# EAGLE schematic Main DIY board (EAGLE 9.0.0)
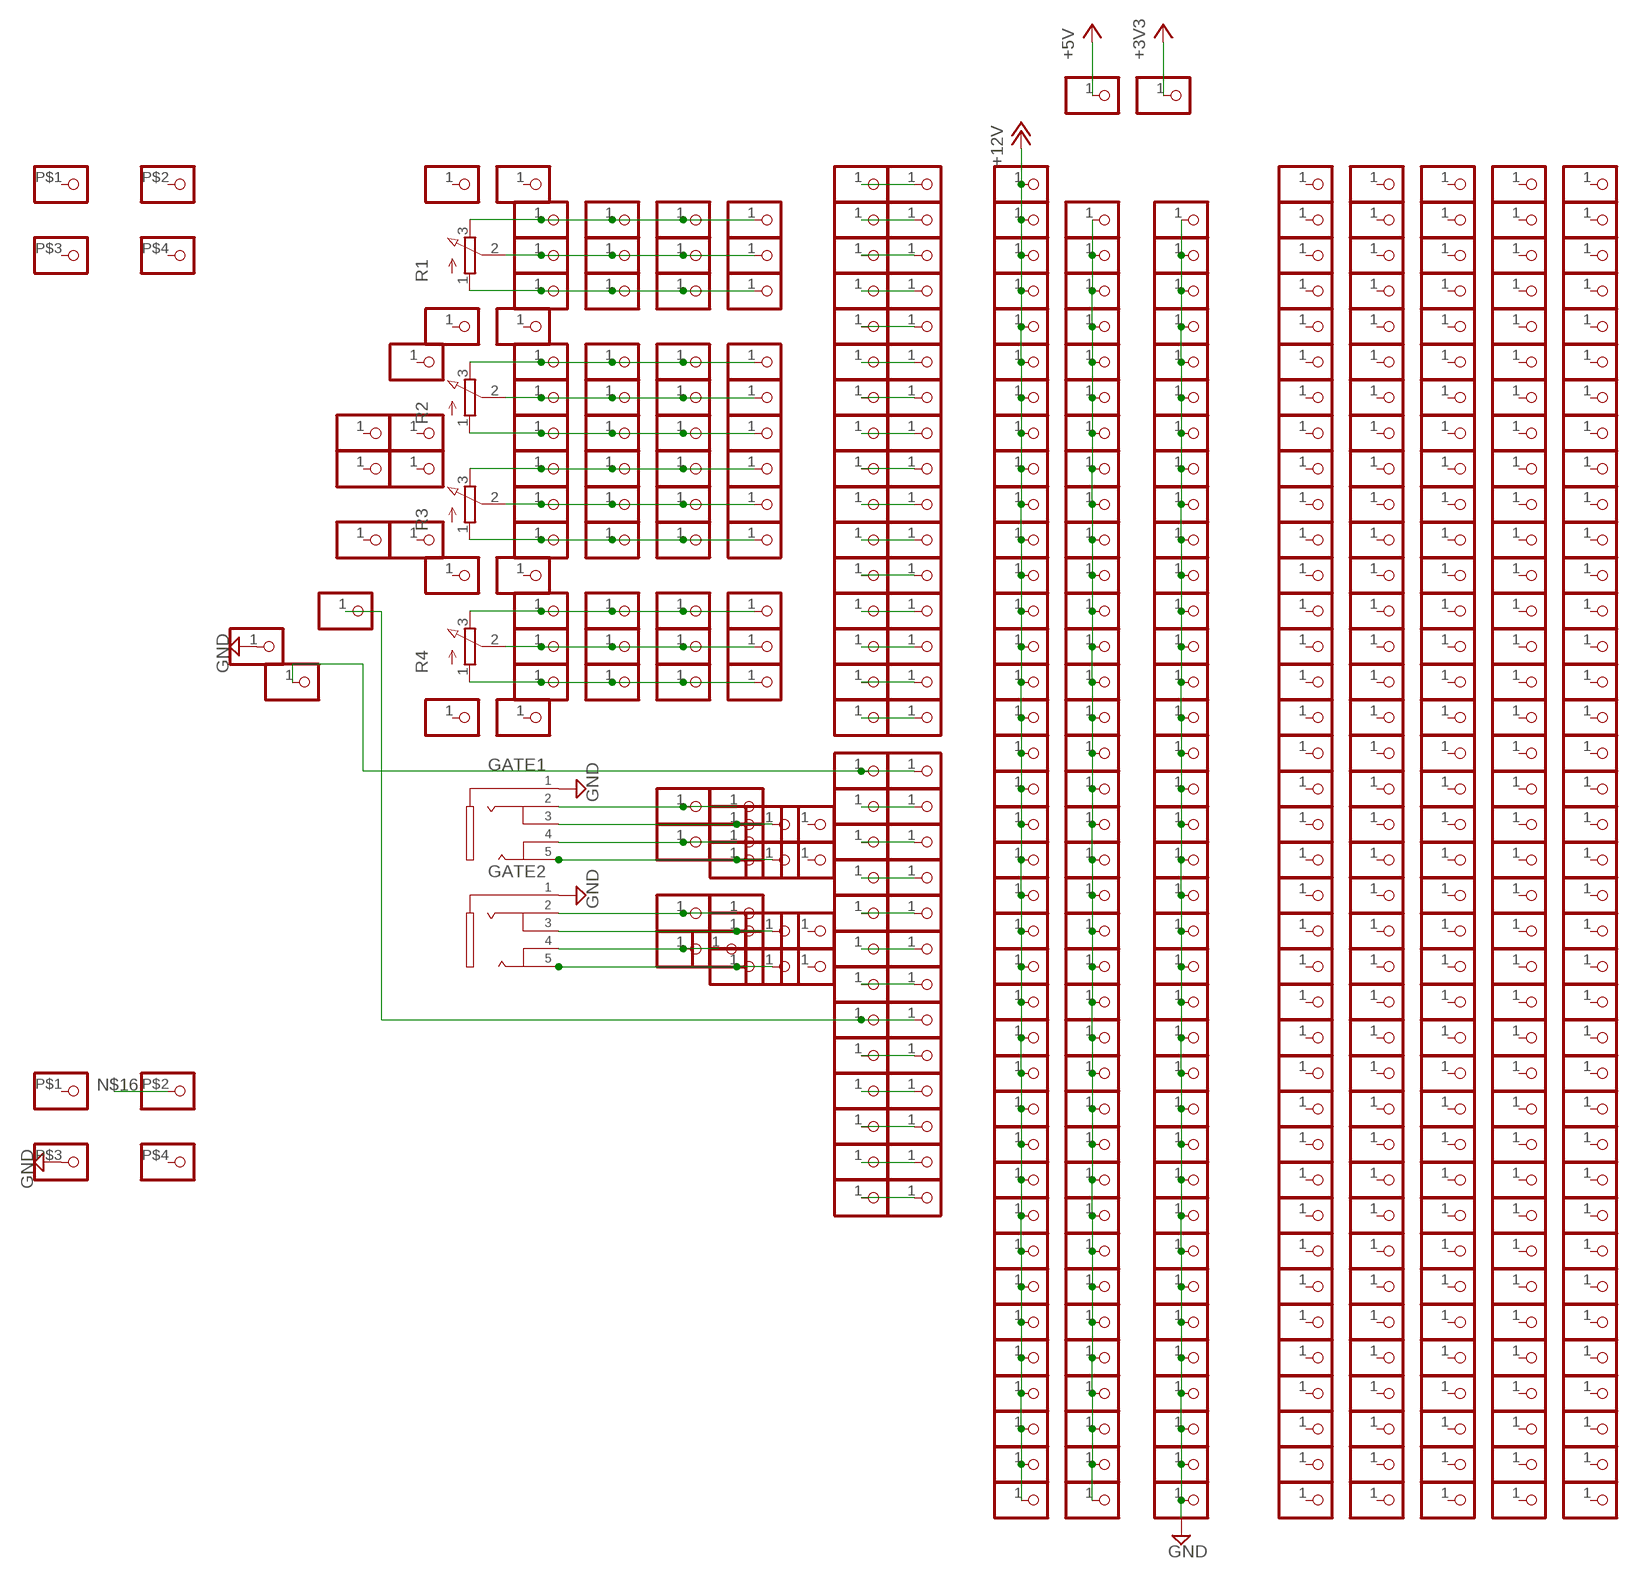
[diagram p0: schematic, sheet 1, part 1 of 2]
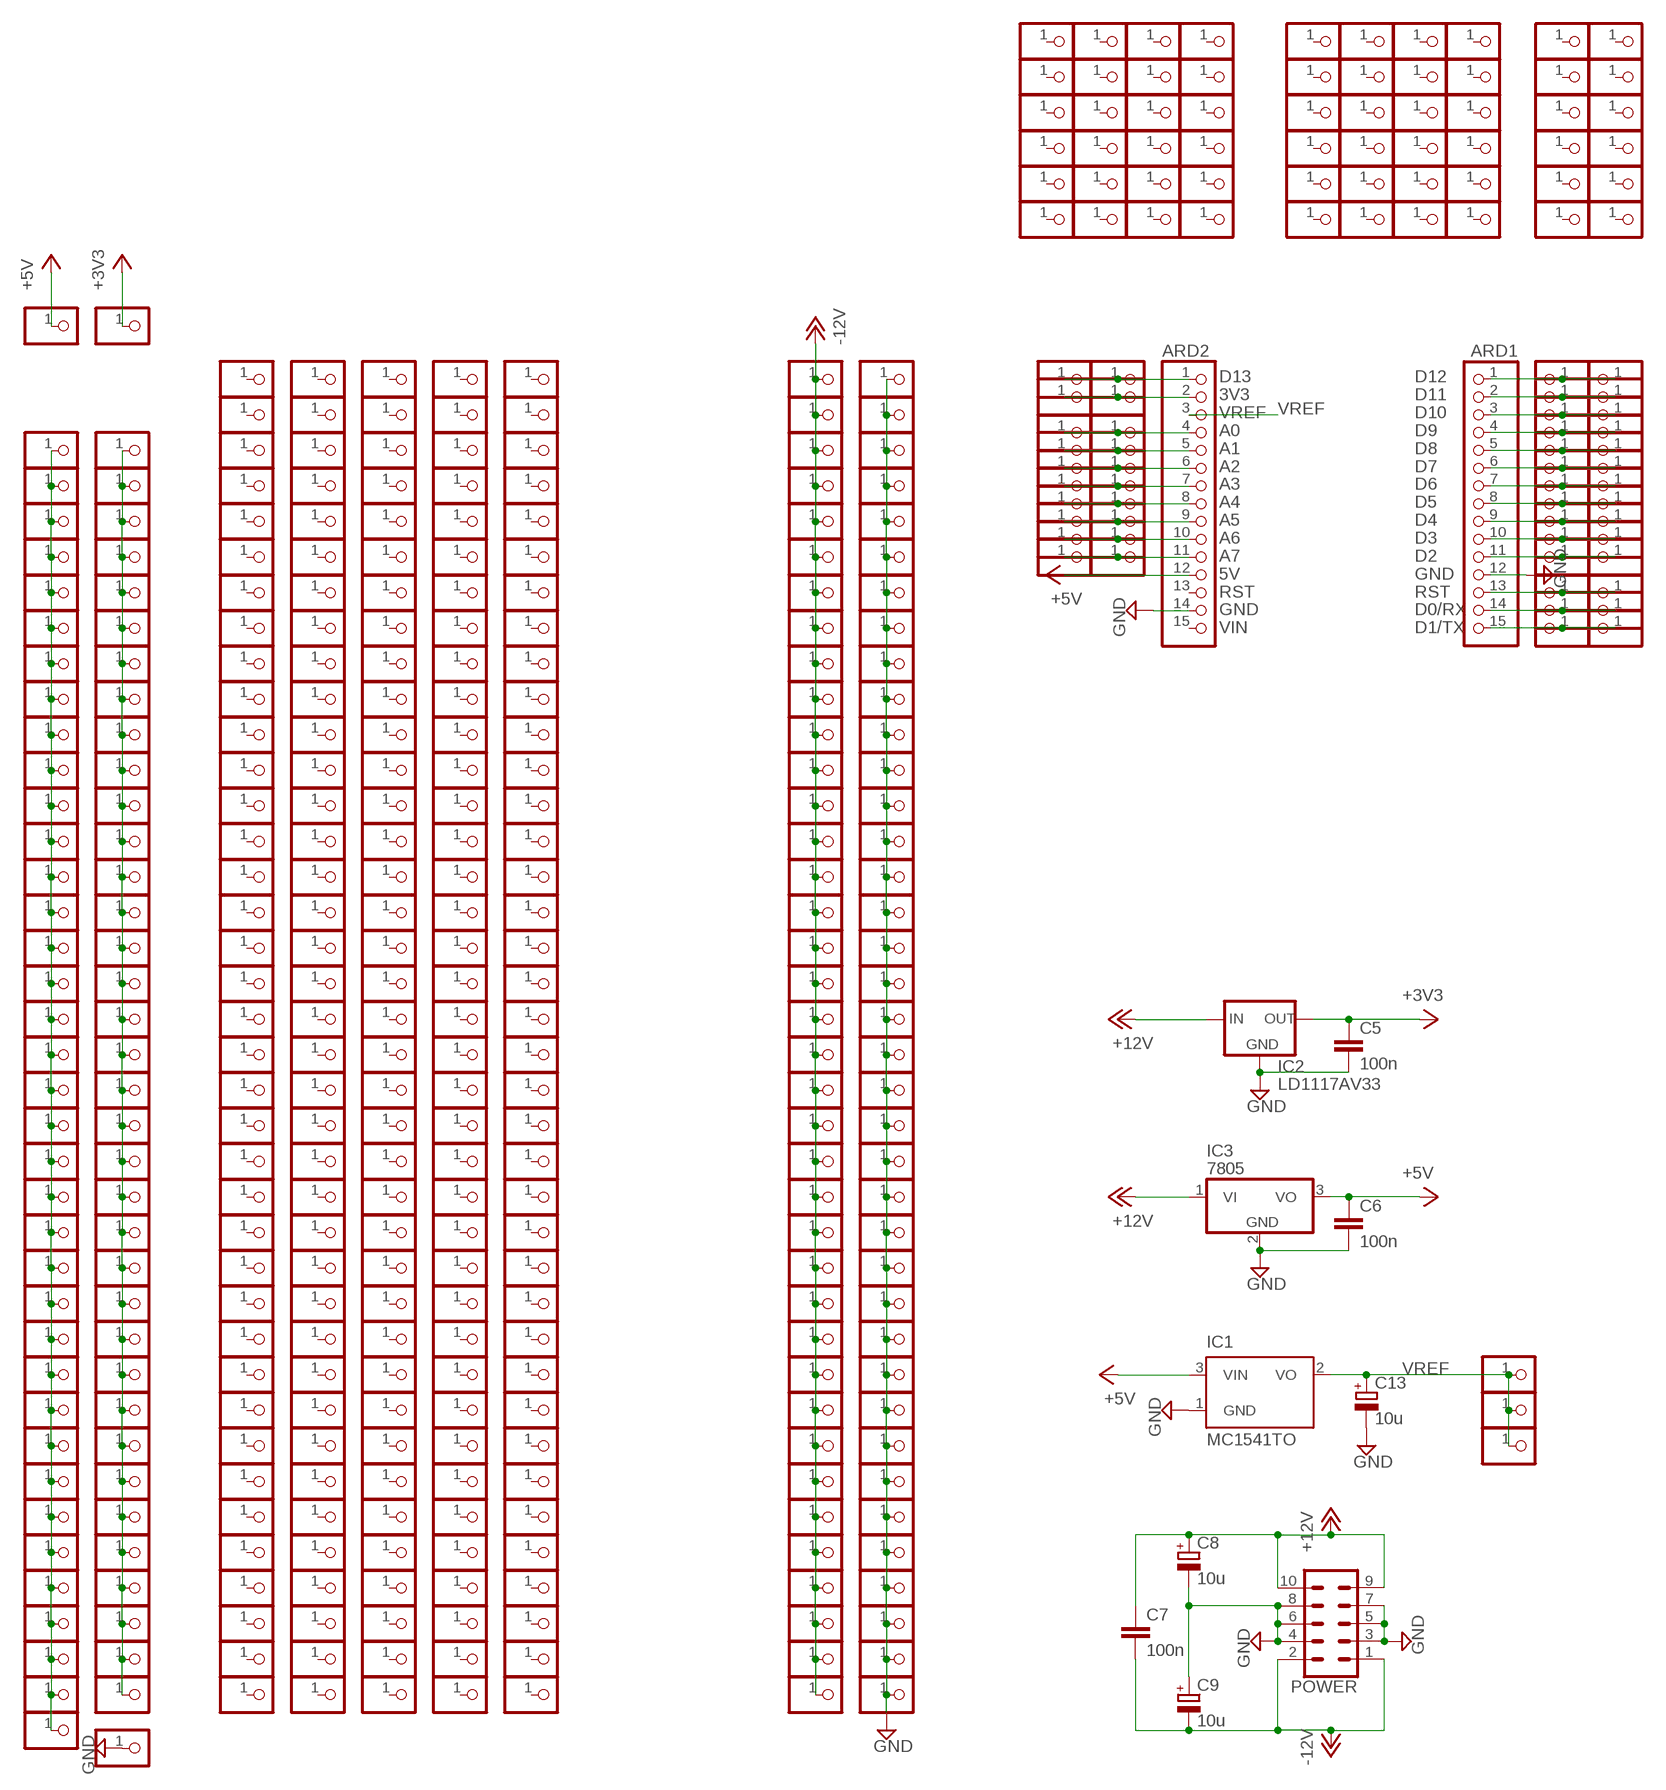
[diagram p1: schematic, sheet 1, part 2 of 2]

## Parts
ARD1  PINHD-1X15  [1X15]
ARD2  PINHD-1X15  [1X15]
C5  100n  C-EU050-025X075  [C050-025X075]
C6  100n  C-EU050-025X075  [C050-025X075]
C7  100n  C-EU050-025X075  [C050-025X075]
C8  10u  CPOL  [E2,5-5]
C9  10u  CPOL  [E2,5-5]
C13  10u  CPOL  [E2,5-5]
GATE1  PJ-324MH  [PJ-324MH]
GATE2  PJ-324MH  [PJ-324MH]
IC1  MC1541TO  [TO92]
IC2  LD1117AV33  V_REG_LD1117VXX  [78XXL]
IC3  7805  7805T  [TO220H]
JP1  1X01  [1X01]
JP2  1X01  [1X01]
JP3  1X01  [1X01]
JP4  1X01  [1X01]
JP5  1X01  [1X01]
JP6  1X01  [1X01]
JP7  1X01  [1X01]
JP8  1X01  [1X01]
JP9  1X01  [1X01]
JP10  1X01  [1X01]
JP11  1X01  [1X01]
JP12  1X01  [1X01]
JP13  1X01  [1X01]
JP14  1X01  [1X01]
JP15  1X01  [1X01]
JP16  1X01  [1X01]
JP17  1X01  [1X01]
JP18  1X01  [1X01]
JP19  1X01  [1X01]
JP20  1X01  [1X01]
JP21  1X01  [1X01]
JP22  1X01  [1X01]
JP23  1X01  [1X01]
JP24  1X01  [1X01]
JP25  1X01  [1X01]
JP26  1X01  [1X01]
JP27  1X01  [1X01]
JP28  1X01  [1X01]
JP29  1X01  [1X01]
JP30  1X01  [1X01]
JP31  1X01  [1X01]
JP32  1X01  [1X01]
JP33  1X01  [1X01]
JP34  1X01  [1X01]
JP35  1X01  [1X01]
JP36  1X01  [1X01]
JP37  1X01  [1X01]
JP38  1X01  [1X01]
JP39  1X01  [1X01]
JP40  1X01  [1X01]
JP41  1X01  [1X01]
JP42  1X01  [1X01]
JP43  1X01  [1X01]
JP44  1X01  [1X01]
JP45  1X01  [1X01]
JP46  1X01  [1X01]
JP47  1X01  [1X01]
JP48  1X01  [1X01]
JP49  1X01  [1X01]
JP50  1X01  [1X01]
JP51  1X01  [1X01]
JP52  1X01  [1X01]
JP53  1X01  [1X01]
JP54  1X01  [1X01]
JP55  1X01  [1X01]
JP56  1X01  [1X01]
JP57  1X01  [1X01]
JP58  1X01  [1X01]
JP59  1X01  [1X01]
JP60  1X01  [1X01]
JP61  1X01  [1X01]
JP62  1X01  [1X01]
JP63  1X01  [1X01]
JP64  1X01  [1X01]
JP65  1X01  [1X01]
JP66  1X01  [1X01]
JP67  1X01  [1X01]
JP68  1X01  [1X01]
JP69  1X01  [1X01]
JP70  1X01  [1X01]
JP71  1X01  [1X01]
JP72  1X01  [1X01]
JP73  1X01  [1X01]
JP74  1X01  [1X01]
JP75  1X01  [1X01]
JP76  1X01  [1X01]
JP77  1X01  [1X01]
JP78  1X01  [1X01]
JP79  1X01  [1X01]
JP80  1X01  [1X01]
JP81  1X01  [1X01]
JP82  1X01  [1X01]
JP83  1X01  [1X01]
JP84  1X01  [1X01]
JP85  1X01  [1X01]
JP86  1X01  [1X01]
JP87  1X01  [1X01]
JP88  1X01  [1X01]
JP89  1X01  [1X01]
JP90  1X01  [1X01]
JP91  1X01  [1X01]
JP92  1X01  [1X01]
JP93  1X01  [1X01]
JP94  1X01  [1X01]
JP95  1X01  [1X01]
JP96  1X01  [1X01]
JP97  1X01  [1X01]
JP98  1X01  [1X01]
JP99  1X01  [1X01]
JP100  1X01  [1X01]
JP101  1X01  [1X01]
JP102  1X01  [1X01]
JP103  1X01  [1X01]
JP104  1X01  [1X01]
JP105  1X01  [1X01]
JP106  1X01  [1X01]
JP107  1X01  [1X01]
JP108  1X01  [1X01]
JP109  1X01  [1X01]
JP110  1X01  [1X01]
JP111  1X01  [1X01]
JP112  1X01  [1X01]
JP113  1X01  [1X01]
JP114  1X01  [1X01]
JP115  1X01  [1X01]
JP116  1X01  [1X01]
JP117  1X01  [1X01]
JP118  1X01  [1X01]
JP119  1X01  [1X01]
JP120  1X01  [1X01]
JP121  1X01  [1X01]
JP122  1X01  [1X01]
JP123  1X01  [1X01]
JP124  1X01  [1X01]
JP125  1X01  [1X01]
JP126  1X01  [1X01]
JP127  1X01  [1X01]
JP128  1X01  [1X01]
JP129  1X01  [1X01]
JP130  1X01  [1X01]
JP131  1X01  [1X01]
JP132  1X01  [1X01]
JP133  1X01  [1X01]
JP134  1X01  [1X01]
JP135  1X01  [1X01]
JP136  1X01  [1X01]
JP137  1X01  [1X01]
JP138  1X01  [1X01]
JP139  1X01  [1X01]
JP140  1X01  [1X01]
JP141  1X01  [1X01]
JP142  1X01  [1X01]
JP143  1X01  [1X01]
JP144  1X01  [1X01]
JP145  1X01  [1X01]
JP146  1X01  [1X01]
JP147  1X01  [1X01]
JP148  1X01  [1X01]
JP149  1X01  [1X01]
JP150  1X01  [1X01]
JP151  1X01  [1X01]
JP152  1X01  [1X01]
JP153  1X01  [1X01]
JP154  1X01  [1X01]
JP155  1X01  [1X01]
JP156  1X01  [1X01]
JP157  1X01  [1X01]
JP158  1X01  [1X01]
JP159  1X01  [1X01]
JP160  1X01  [1X01]
JP161  1X01  [1X01]
JP162  1X01  [1X01]
JP163  1X01  [1X01]
JP164  1X01  [1X01]
JP165  1X01  [1X01]
JP166  1X01  [1X01]
JP167  1X01  [1X01]
JP168  1X01  [1X01]
JP169  1X01  [1X01]
JP170  1X01  [1X01]
JP171  1X01  [1X01]
JP172  1X01  [1X01]
JP173  1X01  [1X01]
JP174  1X01  [1X01]
JP175  1X01  [1X01]
JP176  1X01  [1X01]
JP177  1X01  [1X01]
JP178  1X01  [1X01]
JP179  1X01  [1X01]
JP180  1X01  [1X01]
JP181  1X01  [1X01]
JP182  1X01  [1X01]
JP183  1X01  [1X01]
JP184  1X01  [1X01]
JP185  1X01  [1X01]
JP186  1X01  [1X01]
JP187  1X01  [1X01]
JP188  1X01  [1X01]
JP189  1X01  [1X01]
JP190  1X01  [1X01]
JP191  1X01  [1X01]
JP192  1X01  [1X01]
JP193  1X01  [1X01]
JP194  1X01  [1X01]
JP195  1X01  [1X01]
JP196  1X01  [1X01]
JP197  1X01  [1X01]
JP198  1X01  [1X01]
JP199  1X01  [1X01]
JP200  1X01  [1X01]
JP201  1X01  [1X01]
JP202  1X01  [1X01]
JP203  1X01  [1X01]
JP204  1X01  [1X01]
JP205  1X01  [1X01]
JP206  1X01  [1X01]
JP207  1X01  [1X01]
JP208  1X01  [1X01]
JP209  1X01  [1X01]
JP210  1X01  [1X01]
JP211  1X01  [1X01]
JP212  1X01  [1X01]
JP213  1X01  [1X01]
JP214  1X01  [1X01]
JP215  1X01  [1X01]
JP216  1X01  [1X01]
JP217  1X01  [1X01]
JP218  1X01  [1X01]
JP219  1X01  [1X01]
JP220  1X01  [1X01]
JP221  1X01  [1X01]
JP222  1X01  [1X01]
JP223  1X01  [1X01]
JP224  1X01  [1X01]
JP225  1X01  [1X01]
JP226  1X01  [1X01]
JP227  1X01  [1X01]
JP228  1X01  [1X01]
JP229  1X01  [1X01]
JP230  1X01  [1X01]
JP231  1X01  [1X01]
JP232  1X01  [1X01]
JP233  1X01  [1X01]
JP234  1X01  [1X01]
JP235  1X01  [1X01]
JP236  1X01  [1X01]
JP237  1X01  [1X01]
JP238  1X01  [1X01]
JP239  1X01  [1X01]
JP240  1X01  [1X01]
JP241  1X01  [1X01]
JP242  1X01  [1X01]
JP243  1X01  [1X01]
JP244  1X01  [1X01]
JP245  1X01  [1X01]
JP246  1X01  [1X01]
JP247  1X01  [1X01]
JP248  1X01  [1X01]
JP249  1X01  [1X01]
JP250  1X01  [1X01]
JP251  1X01  [1X01]
JP252  1X01  [1X01]
JP253  1X01  [1X01]
JP254  1X01  [1X01]
JP255  1X01  [1X01]
JP256  1X01  [1X01]
JP257  1X01  [1X01]
JP258  1X01  [1X01]
JP259  1X01  [1X01]
JP260  1X01  [1X01]
JP261  1X01  [1X01]
JP262  1X01  [1X01]
JP263  1X01  [1X01]
JP264  1X01  [1X01]
JP265  1X01  [1X01]
JP266  1X01  [1X01]
JP267  1X01  [1X01]
JP268  1X01  [1X01]
JP269  1X01  [1X01]
JP270  1X01  [1X01]
JP271  1X01  [1X01]
JP272  1X01  [1X01]
JP273  1X01  [1X01]
JP274  1X01  [1X01]
JP275  1X01  [1X01]
JP276  1X01  [1X01]
JP277  1X01  [1X01]
JP278  1X01  [1X01]
JP279  1X01  [1X01]
JP280  1X01  [1X01]
JP281  1X01  [1X01]
JP282  1X01  [1X01]
JP283  1X01  [1X01]
JP284  1X01  [1X01]
JP285  1X01  [1X01]
JP286  1X01  [1X01]
JP287  1X01  [1X01]
JP288  1X01  [1X01]
JP289  1X01  [1X01]
JP290  1X01  [1X01]
JP291  1X01  [1X01]
JP292  1X01  [1X01]
JP293  1X01  [1X01]
JP294  1X01  [1X01]
JP295  1X01  [1X01]
JP296  1X01  [1X01]
JP297  1X01  [1X01]
JP298  1X01  [1X01]
JP299  1X01  [1X01]
JP300  1X01  [1X01]
JP301  1X01  [1X01]
JP302  1X01  [1X01]
JP303  1X01  [1X01]
JP304  1X01  [1X01]
JP305  1X01  [1X01]
JP306  1X01  [1X01]
JP307  1X01  [1X01]
JP308  1X01  [1X01]
JP309  1X01  [1X01]
JP310  1X01  [1X01]
JP311  1X01  [1X01]
JP312  1X01  [1X01]
JP313  1X01  [1X01]
JP314  1X01  [1X01]
JP315  1X01  [1X01]
JP316  1X01  [1X01]
JP317  1X01  [1X01]
JP318  1X01  [1X01]
JP319  1X01  [1X01]
JP320  1X01  [1X01]
JP321  1X01  [1X01]
JP322  1X01  [1X01]
JP323  1X01  [1X01]
JP324  1X01  [1X01]
JP325  1X01  [1X01]
JP326  1X01  [1X01]
JP327  1X01  [1X01]
JP328  1X01  [1X01]
JP329  1X01  [1X01]
JP330  1X01  [1X01]
JP331  1X01  [1X01]
JP332  1X01  [1X01]
JP333  1X01  [1X01]
JP334  1X01  [1X01]
JP335  1X01  [1X01]
JP336  1X01  [1X01]
JP337  1X01  [1X01]
JP338  1X01  [1X01]
JP339  1X01  [1X01]
JP340  1X01  [1X01]
JP341  1X01  [1X01]
JP342  1X01  [1X01]
JP343  1X01  [1X01]
JP344  1X01  [1X01]
JP345  1X01  [1X01]
JP346  1X01  [1X01]
JP347  1X01  [1X01]
JP348  1X01  [1X01]
JP349  1X01  [1X01]
JP350  1X01  [1X01]
JP351  1X01  [1X01]
JP352  1X01  [1X01]
JP353  1X01  [1X01]
JP354  1X01  [1X01]
JP355  1X01  [1X01]
JP356  1X01  [1X01]
JP357  1X01  [1X01]
JP358  1X01  [1X01]
JP359  1X01  [1X01]
JP360  1X01  [1X01]
JP361  1X01  [1X01]
JP362  1X01  [1X01]
JP363  1X01  [1X01]
JP364  1X01  [1X01]
JP365  1X01  [1X01]
JP366  1X01  [1X01]
JP367  1X01  [1X01]
JP368  1X01  [1X01]
JP369  1X01  [1X01]
JP370  1X01  [1X01]
JP371  1X01  [1X01]
JP372  1X01  [1X01]
JP373  1X01  [1X01]
JP374  1X01  [1X01]
JP375  1X01  [1X01]
JP376  1X01  [1X01]
JP377  1X01  [1X01]
JP378  1X01  [1X01]
JP379  1X01  [1X01]
JP380  1X01  [1X01]
JP381  1X01  [1X01]
JP382  1X01  [1X01]
JP383  1X01  [1X01]
JP384  1X01  [1X01]
JP385  1X01  [1X01]
JP386  1X01  [1X01]
JP387  1X01  [1X01]
JP388  1X01  [1X01]
JP389  1X01  [1X01]
JP390  1X01  [1X01]
JP391  1X01  [1X01]
JP392  1X01  [1X01]
JP393  1X01  [1X01]
JP394  1X01  [1X01]
JP395  1X01  [1X01]
JP396  1X01  [1X01]
JP397  1X01  [1X01]
JP398  1X01  [1X01]
JP399  1X01  [1X01]
JP400  1X01  [1X01]
JP401  1X01  [1X01]
JP402  1X01  [1X01]
JP403  1X01  [1X01]
JP404  1X01  [1X01]
JP405  1X01  [1X01]
JP406  1X01  [1X01]
JP407  1X01  [1X01]
JP408  1X01  [1X01]
JP409  1X01  [1X01]
JP410  1X01  [1X01]
JP411  1X01  [1X01]
JP412  1X01  [1X01]
JP413  1X01  [1X01]
JP414  1X01  [1X01]
JP415  1X01  [1X01]
JP416  1X01  [1X01]
JP417  1X01  [1X01]
JP418  1X01  [1X01]
JP419  1X01  [1X01]
JP420  1X01  [1X01]
JP421  1X01  [1X01]
JP422  1X01  [1X01]
JP423  1X01  [1X01]
JP424  1X01  [1X01]
JP425  1X01  [1X01]
JP426  1X01  [1X01]
JP427  1X01  [1X01]
JP428  1X01  [1X01]
JP429  1X01  [1X01]
JP430  1X01  [1X01]
JP431  1X01  [1X01]
JP432  1X01  [1X01]
JP433  1X01  [1X01]
JP434  1X01  [1X01]
JP435  1X01  [1X01]
JP436  1X01  [1X01]
JP437  1X01  [1X01]
JP438  1X01  [1X01]
JP439  1X01  [1X01]
JP440  1X01  [1X01]
JP441  1X01  [1X01]
JP442  1X01  [1X01]
JP443  1X01  [1X01]
JP444  1X01  [1X01]
JP445  1X01  [1X01]
JP446  1X01  [1X01]
JP447  1X01  [1X01]
JP448  1X01  [1X01]
JP449  1X01  [1X01]
JP450  1X01  [1X01]
JP451  1X01  [1X01]
JP452  1X01  [1X01]
JP453  1X01  [1X01]
JP454  1X01  [1X01]
JP455  1X01  [1X01]
JP456  1X01  [1X01]
JP457  1X01  [1X01]
JP458  1X01  [1X01]
JP459  1X01  [1X01]
JP460  1X01  [1X01]
JP461  1X01  [1X01]
JP462  1X01  [1X01]
JP463  1X01  [1X01]
JP464  1X01  [1X01]
JP465  1X01  [1X01]
JP466  1X01  [1X01]
JP467  1X01  [1X01]
JP468  1X01  [1X01]
JP469  1X01  [1X01]
JP470  1X01  [1X01]
JP471  1X01  [1X01]
JP472  1X01  [1X01]
JP473  1X01  [1X01]
JP474  1X01  [1X01]
JP475  1X01  [1X01]
JP476  1X01  [1X01]
JP477  1X01  [1X01]
JP478  1X01  [1X01]
JP479  1X01  [1X01]
JP480  1X01  [1X01]
JP481  1X01  [1X01]
JP482  1X01  [1X01]
JP483  1X01  [1X01]
JP484  1X01  [1X01]
JP485  1X01  [1X01]
JP486  1X01  [1X01]
JP487  1X01  [1X01]
JP488  1X01  [1X01]
JP489  1X01  [1X01]
JP490  1X01  [1X01]
JP491  1X01  [1X01]
JP492  1X01  [1X01]
JP493  1X01  [1X01]
JP494  1X01  [1X01]
JP495  1X01  [1X01]
JP496  1X01  [1X01]
JP497  1X01  [1X01]
JP498  1X01  [1X01]
JP499  1X01  [1X01]
JP500  1X01  [1X01]
JP501  1X01  [1X01]
JP502  1X01  [1X01]
JP503  1X01  [1X01]
JP504  1X01  [1X01]
JP505  1X01  [1X01]
JP506  1X01  [1X01]
JP507  1X01  [1X01]
JP508  1X01  [1X01]
JP509  1X01  [1X01]
JP510  1X01  [1X01]
JP511  1X01  [1X01]
JP512  1X01  [1X01]
JP513  1X01  [1X01]
JP514  1X01  [1X01]
JP515  1X01  [1X01]
JP516  1X01  [1X01]
JP517  1X01  [1X01]
JP518  1X01  [1X01]
JP519  1X01  [1X01]
JP520  1X01  [1X01]
JP521  1X01  [1X01]
JP522  1X01  [1X01]
JP523  1X01  [1X01]
JP524  1X01  [1X01]
JP525  1X01  [1X01]
JP526  1X01  [1X01]
JP527  1X01  [1X01]
JP528  1X01  [1X01]
JP529  1X01  [1X01]
JP530  1X01  [1X01]
JP531  1X01  [1X01]
JP532  1X01  [1X01]
JP533  1X01  [1X01]
JP534  1X01  [1X01]
JP535  1X01  [1X01]
JP536  1X01  [1X01]
JP537  1X01  [1X01]
JP538  1X01  [1X01]
JP539  1X01  [1X01]
JP540  1X01  [1X01]
JP541  1X01  [1X01]
JP542  1X01  [1X01]
JP543  1X01  [1X01]
JP544  1X01  [1X01]
JP545  1X01  [1X01]
JP546  1X01  [1X01]
JP547  1X01  [1X01]
JP548  1X01  [1X01]
JP549  1X01  [1X01]
JP550  1X01  [1X01]
JP551  1X01  [1X01]
JP552  1X01  [1X01]
JP553  1X01  [1X01]
JP554  1X01  [1X01]
JP555  1X01  [1X01]
JP556  1X01  [1X01]
JP557  1X01  [1X01]
JP558  1X01  [1X01]
JP559  1X01  [1X01]
JP560  1X01  [1X01]
JP561  1X01  [1X01]
JP562  1X01  [1X01]
JP563  1X01  [1X01]
JP564  1X01  [1X01]
JP565  1X01  [1X01]
JP566  1X01  [1X01]
JP567  1X01  [1X01]
JP568  1X01  [1X01]
JP569  1X01  [1X01]
JP570  1X01  [1X01]
JP571  1X01  [1X01]
JP572  1X01  [1X01]
JP573  1X01  [1X01]
JP574  1X01  [1X01]
JP575  1X01  [1X01]
JP576  1X01  [1X01]
JP577  1X01  [1X01]
JP578  1X01  [1X01]
JP579  1X01  [1X01]
JP580  1X01  [1X01]
JP581  1X01  [1X01]
JP582  1X01  [1X01]
JP583  1X01  [1X01]
JP584  1X01  [1X01]
JP585  1X01  [1X01]
JP586  1X01  [1X01]
JP587  1X01  [1X01]
JP588  1X01  [1X01]
JP589  1X01  [1X01]
JP590  1X01  [1X01]
JP591  1X01  [1X01]
JP592  1X01  [1X01]
JP593  1X01  [1X01]
JP594  1X01  [1X01]
JP595  1X01  [1X01]
JP596  1X01  [1X01]
JP597  1X01  [1X01]
JP598  1X01  [1X01]
JP599  1X01  [1X01]
JP600  1X01  [1X01]
JP601  1X01  [1X01]
JP602  1X01  [1X01]
JP603  1X01  [1X01]
JP604  1X01  [1X01]
JP605  1X01  [1X01]
JP606  1X01  [1X01]
JP607  1X01  [1X01]
JP608  1X01  [1X01]
JP609  1X01  [1X01]
JP610  1X01  [1X01]
JP611  1X01  [1X01]
JP612  1X01  [1X01]
JP613  1X01  [1X01]
JP614  1X01  [1X01]
JP615  1X01  [1X01]
JP616  1X01  [1X01]
JP617  1X01  [1X01]
JP618  1X01  [1X01]
JP619  1X01  [1X01]
JP620  1X01  [1X01]
JP621  1X01  [1X01]
JP622  1X01  [1X01]
JP623  1X01  [1X01]
JP624  1X01  [1X01]
JP625  1X01  [1X01]
JP626  1X01  [1X01]
JP627  1X01  [1X01]
JP628  1X01  [1X01]
JP629  1X01  [1X01]
JP630  1X01  [1X01]
JP631  1X01  [1X01]
JP632  1X01  [1X01]
JP633  1X01  [1X01]
JP634  1X01  [1X01]
JP635  1X01  [1X01]
JP636  1X01  [1X01]
JP637  1X01  [1X01]
JP638  1X01  [1X01]
JP639  1X01  [1X01]
JP640  1X01  [1X01]
JP641  1X01  [1X01]
JP642  1X01  [1X01]
JP643  1X01  [1X01]
JP644  1X01  [1X01]
JP645  1X01  [1X01]
JP646  1X01  [1X01]
JP647  1X01  [1X01]
JP648  1X01  [1X01]
JP649  1X01  [1X01]
JP650  1X01  [1X01]
JP651  1X01  [1X01]
JP652  1X01  [1X01]
JP653  1X01  [1X01]
JP654  1X01  [1X01]
JP655  1X01  [1X01]
JP656  1X01  [1X01]
JP657  1X01  [1X01]
JP658  1X01  [1X01]
JP659  1X01  [1X01]
JP660  1X01  [1X01]
JP661  1X01  [1X01]
JP662  1X01  [1X01]
JP663  1X01  [1X01]
JP664  1X01  [1X01]
JP665  1X01  [1X01]
JP666  1X01  [1X01]
JP667  1X01  [1X01]
JP668  1X01  [1X01]
JP669  1X01  [1X01]
JP670  1X01  [1X01]
JP671  1X01  [1X01]
JP672  1X01  [1X01]
JP673  1X01  [1X01]
JP674  1X01  [1X01]
JP675  1X01  [1X01]
JP676  1X01  [1X01]
JP677  1X01  [1X01]
JP678  1X01  [1X01]
JP679  1X01  [1X01]
JP680  1X01  [1X01]
JP681  1X01  [1X01]
JP682  1X01  [1X01]
JP683  1X01  [1X01]
JP684  1X01  [1X01]
JP685  1X01  [1X01]
JP686  1X01  [1X01]
JP687  1X01  [1X01]
JP688  1X01  [1X01]
JP689  1X01  [1X01]
JP690  1X01  [1X01]
JP691  1X01  [1X01]
JP692  1X01  [1X01]
JP693  1X01  [1X01]
JP694  1X01  [1X01]
JP695  1X01  [1X01]
JP696  1X01  [1X01]
JP697  1X01  [1X01]
JP698  1X01  [1X01]
JP699  1X01  [1X01]
JP700  1X01  [1X01]
JP701  1X01  [1X01]
JP702  1X01  [1X01]
JP703  1X01  [1X01]
JP704  1X01  [1X01]
JP705  1X01  [1X01]
JP706  1X01  [1X01]
JP707  1X01  [1X01]
JP708  1X01  [1X01]
JP709  1X01  [1X01]
JP710  1X01  [1X01]
JP711  1X01  [1X01]
JP712  1X01  [1X01]
JP713  1X01  [1X01]
JP714  1X01  [1X01]
JP715  1X01  [1X01]
JP716  1X01  [1X01]
JP717  1X01  [1X01]
JP718  1X01  [1X01]
JP719  1X01  [1X01]
JP720  1X01  [1X01]
JP721  1X01  [1X01]
JP722  1X01  [1X01]
JP723  1X01  [1X01]
JP724  1X01  [1X01]
JP725  1X01  [1X01]
JP726  1X01  [1X01]
JP727  1X01  [1X01]
JP728  1X01  [1X01]
JP729  1X01  [1X01]
JP730  1X01  [1X01]
JP731  1X01  [1X01]
JP732  1X01  [1X01]
JP733  1X01  [1X01]
JP734  1X01  [1X01]
JP735  1X01  [1X01]
JP736  1X01  [1X01]
JP737  1X01  [1X01]
JP738  1X01  [1X01]
JP739  1X01  [1X01]
JP740  1X01  [1X01]
JP741  1X01  [1X01]
JP742  1X01  [1X01]
JP743  1X01  [1X01]
JP744  1X01  [1X01]
JP745  1X01  [1X01]
JP746  1X01  [1X01]
JP747  1X01  [1X01]
JP748  1X01  [1X01]
JP749  1X01  [1X01]
JP750  1X01  [1X01]
JP751  1X01  [1X01]
JP752  1X01  [1X01]
JP753  1X01  [1X01]
JP754  1X01  [1X01]
JP755  1X01  [1X01]
JP756  1X01  [1X01]
JP757  1X01  [1X01]
JP758  1X01  [1X01]
JP759  1X01  [1X01]
JP760  1X01  [1X01]
JP761  1X01  [1X01]
JP762  1X01  [1X01]
JP763  1X01  [1X01]
JP764  1X01  [1X01]
JP765  1X01  [1X01]
JP766  1X01  [1X01]
JP767  1X01  [1X01]
JP768  1X01  [1X01]
JP769  1X01  [1X01]
JP770  1X01  [1X01]
JP771  1X01  [1X01]
JP772  1X01  [1X01]
JP773  1X01  [1X01]
JP774  1X01  [1X01]
JP775  1X01  [1X01]
JP776  1X01  [1X01]
JP777  1X01  [1X01]
JP778  1X01  [1X01]
JP779  1X01  [1X01]
JP780  1X01  [1X01]
JP781  1X01  [1X01]
JP782  1X01  [1X01]
JP783  1X01  [1X01]
JP785  1X01  [1X01]
JP786  1X01  [1X01]
JP787  1X01  [1X01]
JP788  1X01-WIDE  [1X01-WIDE]
JP789  1X01-WIDE  [1X01-WIDE]
JP790  1X01-WIDE  [1X01-WIDE]
JP791  1X01  [1X01]
JP792  1X01  [1X01]
JP793  1X01  [1X01]
JP794  1X01  [1X01]
JP795  1X01  [1X01]
JP796  1X01  [1X01]
JP797  1X01  [1X01]
JP798  1X01  [1X01]
JP799  1X01  [1X01]
JP800  1X01  [1X01]
JP801  1X01  [1X01]
JP802  1X01  [1X01]
JP803  1X01  [1X01]
JP804  1X01  [1X01]
JP805  1X01  [1X01]
JP806  1X01  [1X01]
JP807  1X01  [1X01]
JP808  1X01  [1X01]
JP809  1X01  [1X01]
JP810  1X01  [1X01]
JP811  1X01  [1X01]
JP812  1X01  [1X01]
JP813  1X01  [1X01]
JP814  1X01  [1X01]
JP815  1X01  [1X01]
JP816  1X01  [1X01]
JP817  1X01  [1X01]
JP818  1X01  [1X01]
JP819  1X01  [1X01]
JP820  1X01  [1X01]
JP821  1X01  [1X01]
JP822  1X01  [1X01]
JP823  1X01  [1X01]
JP824  1X01  [1X01]
JP825  1X01  [1X01]
JP826  1X01  [1X01]
JP827  1X01  [1X01]
JP828  1X01  [1X01]
JP829  1X01  [1X01]
JP830  1X01  [1X01]
JP831  1X01  [1X01]
JP832  1X01  [1X01]
JP833  1X01  [1X01]
JP834  1X01  [1X01]
JP835  1X01  [1X01]
JP836  1X01  [1X01]
JP837  1X01  [1X01]
JP838  1X01  [1X01]
JP839  1X01  [1X01]
JP840  1X01  [1X01]
JP841  1X01  [1X01]
JP842  1X01  [1X01]
JP843  1X01  [1X01]
JP844  1X01  [1X01]
JP845  1X01  [1X01]
JP846  1X01  [1X01]
JP847  1X01  [1X01]
JP848  1X01  [1X01]
JP849  1X01  [1X01]
JP850  1X01  [1X01]
JP851  1X01  [1X01]
JP852  1X01  [1X01]
JP853  1X01  [1X01]
JP854  1X01  [1X01]
JP855  1X01  [1X01]
JP856  1X01  [1X01]
JP857  1X01  [1X01]
JP858  1X01  [1X01]
JP859  1X01  [1X01]
JP860  1X01  [1X01]
JP861  1X01  [1X01]
JP862  1X01  [1X01]
JP863  1X01  [1X01]
JP864  1X01  [1X01]
JP865  1X01  [1X01]
JP866  1X01  [1X01]
JP867  1X01  [1X01]
JP868  1X01  [1X01]
JP869  1X01  [1X01]
JP870  1X01  [1X01]
JP871  1X01  [1X01]
JP872  1X01  [1X01]
JP873  1X01  [1X01]
JP874  1X01  [1X01]
JP875  1X01  [1X01]
JP876  1X01  [1X01]
JP877  1X01  [1X01]
JP878  1X01  [1X01]
JP879  1X01  [1X01]
JP880  1X01  [1X01]
JP881  1X01  [1X01]
JP882  1X01  [1X01]
JP883  1X01  [1X01]
JP884  1X01  [1X01]
JP885  1X01  [1X01]
JP886  1X01  [1X01]
JP887  1X01  [1X01]
JP888  1X01  [1X01]
JP889  1X01  [1X01]
JP890  1X01  [1X01]
JP891  1X01  [1X01]
JP892  1X01  [1X01]
JP893  1X01  [1X01]
JP894  1X01  [1X01]
JP895  1X01  [1X01]
JP896  1X01  [1X01]
JP897  1X01  [1X01]
JP898  1X01  [1X01]
JP899  1X01  [1X01]
JP900  1X01  [1X01]
JP901  1X01  [1X01]
JP902  1X01  [1X01]
POWER  CONN_05X2SHD  [2X5-SHROUDED]
R1  3RP/1610N  [3RP/1610N]
R2  3RP/1610N  [3RP/1610N]
R3  3RP/1610N  [3RP/1610N]
R4  3RP/1610N  [3RP/1610N]
U$1  RIGHTANGLE  [RIGHTANGLE]
U$2  RIGHTANGLE  [RIGHTANGLE]

## Nets
+3V3 [power]: C5.1 IC2.GND(OUT) JP345.1 JP779.1
+5V [power]: ARD2.12 C6.1 IC1.3(VIN) IC3.3(VO) JP344.1 JP778.1
+12V: C7.1 C8.+ IC2.OUT(IN) IC3.1(VI) JP114.1 JP115.1 JP117.1 JP118.1 JP119.1 JP120.1 JP121.1 JP122.1 JP123.1 JP124.1 JP125.1 JP126.1 JP127.1 JP128.1 JP129.1 JP130.1 JP131.1 JP132.1 JP133.1 JP134.1 JP135.1 JP136.1 JP137.1 JP138.1 JP139.1 JP140.1 JP141.1 JP142.1 JP143.1 JP144.1 JP145.1 JP146.1 JP147.1 JP148.1 JP149.1 JP150.1 JP151.1 JP152.1 POWER.9 POWER.10
-12V: C7.2 C9.- JP267.1 JP268.1 JP269.1 JP270.1 JP271.1 JP272.1 JP273.1 JP274.1 JP275.1 JP276.1 JP277.1 JP278.1 JP279.1 JP280.1 JP281.1 JP282.1 JP283.1 JP284.1 JP285.1 JP286.1 JP287.1 JP288.1 JP289.1 JP290.1 JP291.1 JP292.1 JP293.1 JP294.1 JP295.1 JP296.1 JP297.1 JP298.1 JP299.1 JP300.1 JP301.1 JP302.1 JP303.1 JP304.1 POWER.1 POWER.2
GND: ARD1.12 ARD2.14 C5.2 C6.2 C8.- C9.+ C13.- GATE1.1 GATE2.1 IC1.1(GND) IC2.IN(GND) IC3.2(GND) JP154.1 JP155.1 JP156.1 JP157.1 JP158.1 JP159.1 JP160.1 JP161.1 JP162.1 JP163.1 JP164.1 JP165.1 JP166.1 JP167.1 JP168.1 JP169.1 JP170.1 JP171.1 JP172.1 JP173.1 JP174.1 JP175.1 JP176.1 JP177.1 JP178.1 JP179.1 JP180.1 JP181.1 JP182.1 JP183.1 JP184.1 JP185.1 JP186.1 JP187.1 JP188.1 JP189.1 JP190.1 JP305.1 JP306.1 JP307.1 JP308.1 JP309.1 JP310.1 JP311.1 JP312.1 JP313.1 JP314.1 JP315.1 JP316.1 JP317.1 JP318.1 JP319.1 JP320.1 JP321.1 JP322.1 JP323.1 JP324.1 JP325.1 JP326.1 JP327.1 JP328.1 JP329.1 JP330.1 JP331.1 JP332.1 JP333.1 JP334.1 JP335.1 JP336.1 JP337.1 JP338.1 JP339.1 JP340.1 JP341.1 JP342.1 JP343.1 JP788.1 POWER.3 POWER.4 POWER.5 POWER.6 POWER.7 POWER.8 U$2.P$3
N$1: JP14.1 JP15.1 JP16.1 JP51.1 R2.3(E)
N$2: JP2.1 JP3.1 JP5.1 JP45.1 R1.3(E)
N$3: JP17.1 JP18.1 JP19.1 JP53.1 R2.2(S)
N$4: JP6.1 JP7.1 JP8.1 JP47.1 R1.2(S)
N$5: JP9.1 JP10.1 JP11.1 JP49.1 R1.1(A)
N$6: JP20.1 JP21.1 JP22.1 JP55.1 R2.1(A)
N$7: JP23.1 JP24.1 JP25.1 JP57.1 R3.3(E)
N$8: JP26.1 JP27.1 JP28.1 JP59.1 R3.2(S)
N$9: JP29.1 JP30.1 JP31.1 JP61.1 R3.1(A)
N$10: JP34.1 JP35.1 JP36.1 JP63.1 R4.3(E)
N$11: JP37.1 JP38.1 JP39.1 JP65.1 R4.2(S)
N$12: JP40.1 JP41.1 JP42.1 JP67.1 R4.1(A)
N$13: GATE1.5 JP728.1 JP735.1
N$14: GATE2.5 JP732.1 JP740.1
N$15: JP193.1 JP194.1 JP195.1 JP196.1 JP197.1 JP198.1 JP199.1 JP200.1 JP201.1 JP202.1 JP203.1 JP204.1 JP205.1 JP206.1 JP207.1 JP208.1 JP209.1 JP210.1 JP211.1 JP212.1 JP213.1 JP214.1 JP215.1 JP216.1 JP217.1 JP218.1 JP219.1 JP220.1 JP221.1 JP222.1 JP223.1 JP224.1 JP225.1 JP226.1 JP227.1 JP228.1 JP724.1
N$16: GATE1.2 JP725.1 JP733.1 U$2.P$2
N$17: JP230.1 JP232.1 JP233.1 JP234.1 JP235.1 JP236.1 JP237.1 JP238.1 JP239.1 JP240.1 JP241.1 JP242.1 JP243.1 JP244.1 JP245.1 JP246.1 JP247.1 JP248.1 JP249.1 JP250.1 JP251.1 JP252.1 JP253.1 JP254.1 JP255.1 JP256.1 JP257.1 JP258.1 JP259.1 JP260.1 JP261.1 JP262.1 JP263.1 JP264.1 JP265.1 JP723.1
N$18: GATE1.3 JP726.1 JP734.1
N$19: GATE1.4 JP727.1 JP736.1
N$20: GATE2.2 JP729.1 JP737.1
N$21: GATE2.3 JP730.1 JP738.1
N$22: GATE2.4 JP731.1 JP739.1
N$23: JP91.1 JP92.1
N$24: JP742.1 JP743.1 JP744.1 JP745.1 JP746.1 JP747.1 JP748.1 JP749.1 JP750.1 JP751.1 JP752.1 JP753.1 JP754.1 JP755.1 JP756.1 JP757.1 JP758.1 JP759.1 JP760.1 JP761.1 JP762.1 JP763.1 JP764.1 JP765.1 JP766.1 JP767.1 JP768.1 JP769.1 JP770.1 JP771.1 JP772.1 JP773.1 JP774.1 JP775.1 JP776.1 JP777.1 JP780.1
N$25: JP46.1 JP48.1
N$26: JP50.1 JP52.1
N$27: JP54.1 JP56.1
N$28: JP58.1 JP60.1
N$29: JP62.1 JP64.1
N$30: JP66.1 JP68.1
N$31: JP69.1 JP70.1
N$32: JP71.1 JP72.1
N$33: JP73.1 JP74.1
N$34: JP75.1 JP76.1
N$35: JP77.1 JP78.1
N$36: JP79.1 JP80.1
N$37: JP81.1 JP82.1
N$38: JP83.1 JP84.1
N$39: JP85.1 JP86.1
N$40: JP87.1 JP116.1 JP789.1
N$41: JP88.1 JP89.1
N$42: JP90.1 JP93.1
N$43: JP94.1 JP95.1
N$44: JP96.1 JP97.1
N$45: JP98.1 JP99.1
N$46: JP100.1 JP101.1
N$47: ARD2.1 JP795.1 JP796.1
N$48: JP104.1 JP105.1
N$49: JP106.1 JP107.1
N$50: JP108.1 JP109.1
N$51: JP110.1 JP111.1
N$52: JP112.1 JP113.1
N$53: JP102.1 JP103.1 JP790.1
N$54: ARD2.2 JP797.1 JP798.1
N$55: ARD1.11 JP799.1 JP800.1
N$56: ARD2.4 JP801.1 JP802.1
N$57: ARD2.5 JP803.1 JP804.1
N$58: ARD2.6 JP805.1 JP806.1
N$59: ARD2.7 JP807.1 JP808.1
N$60: ARD2.8 JP809.1 JP810.1
N$61: ARD2.9 JP811.1 JP812.1
N$62: ARD2.10 JP813.1 JP814.1
N$63: ARD2.11 JP815.1 JP816.1
N$64: ARD1.10 JP817.1 JP818.1
N$65: ARD1.8 JP819.1 JP820.1
N$66: ARD1.7 JP821.1 JP822.1
N$67: ARD1.6 JP823.1 JP824.1
N$68: ARD1.5 JP825.1 JP826.1
N$69: ARD1.4 JP827.1 JP828.1
N$70: ARD1.3 JP829.1 JP830.1
N$71: ARD1.2 JP831.1 JP832.1
N$72: ARD1.1 JP833.1 JP834.1
N$73: ARD1.9 JP835.1 JP836.1
N$74: ARD1.14 JP837.1 JP838.1
N$75: ARD1.15 JP839.1 JP840.1
N$76: ARD1.13 JP841.1 JP842.1
VREF [power]: ARD2.3 C13.+ IC1.2(VO) JP781.1 JP782.1 JP783.1
Unconnected: ARD2.13 ARD2.15 JP1.1 JP4.1 JP12.1 JP13.1 JP32.1 JP33.1 JP43.1 JP44.1 JP153.1 JP191.1 JP192.1 JP229.1 JP231.1 JP266.1 JP346.1 JP347.1 JP348.1 JP349.1 JP350.1 JP351.1 JP352.1 JP353.1 JP354.1 JP355.1 JP356.1 JP357.1 JP358.1 JP359.1 JP360.1 JP361.1 JP362.1 JP363.1 JP364.1 JP365.1 JP366.1 JP367.1 JP368.1 JP369.1 JP370.1 JP371.1 JP372.1 JP373.1 JP374.1 JP375.1 JP376.1 JP377.1 JP378.1 JP379.1 JP380.1 JP381.1 JP382.1 JP383.1 JP384.1 JP385.1 JP386.1 JP387.1 JP388.1 JP389.1 JP390.1 JP391.1 JP392.1 JP393.1 JP394.1 JP395.1 JP396.1 JP397.1 JP398.1 JP399.1 JP400.1 JP401.1 JP402.1 JP403.1 JP404.1 JP405.1 JP406.1 JP407.1 JP408.1 JP409.1 JP410.1 JP411.1 JP412.1 JP413.1 JP414.1 JP415.1 JP416.1 JP417.1 JP418.1 JP419.1 JP420.1 JP421.1 JP422.1 JP423.1 JP424.1 JP425.1 JP426.1 JP427.1 JP428.1 JP429.1 JP430.1 JP431.1 JP432.1 JP433.1 JP434.1 JP435.1 JP436.1 JP437.1 JP438.1 JP439.1 JP440.1 JP441.1 JP442.1 JP443.1 JP444.1 JP445.1 JP446.1 JP447.1 JP448.1 JP449.1 JP450.1 JP451.1 JP452.1 JP453.1 JP454.1 JP455.1 JP456.1 JP457.1 JP458.1 JP459.1 JP460.1 JP461.1 JP462.1 JP463.1 JP464.1 JP465.1 JP466.1 JP467.1 JP468.1 JP469.1 JP470.1 JP471.1 JP472.1 JP473.1 JP474.1 JP475.1 JP476.1 JP477.1 JP478.1 JP479.1 JP480.1 JP481.1 JP482.1 JP483.1 JP484.1 JP485.1 JP486.1 JP487.1 JP488.1 JP489.1 JP490.1 JP491.1 JP492.1 JP493.1 JP494.1 JP495.1 JP496.1 JP497.1 JP498.1 JP499.1 JP500.1 JP501.1 JP502.1 JP503.1 JP504.1 JP505.1 JP506.1 JP507.1 JP508.1 JP509.1 JP510.1 JP511.1 JP512.1 JP513.1 JP514.1 JP515.1 JP516.1 JP517.1 JP518.1 JP519.1 JP520.1 JP521.1 JP522.1 JP523.1 JP524.1 JP525.1 JP526.1 JP527.1 JP528.1 JP529.1 JP530.1 JP531.1 JP532.1 JP533.1 JP534.1 JP535.1 JP536.1 JP537.1 JP538.1 JP539.1 JP540.1 JP541.1 JP542.1 JP543.1 JP544.1 JP545.1 JP546.1 JP547.1 JP548.1 JP549.1 JP550.1 JP551.1 JP552.1 JP553.1 JP554.1 JP555.1 JP556.1 JP557.1 JP558.1 JP559.1 JP560.1 JP561.1 JP562.1 JP563.1 JP564.1 JP565.1 JP566.1 JP567.1 JP568.1 JP569.1 JP570.1 JP571.1 JP572.1 JP573.1 JP574.1 JP575.1 JP576.1 JP577.1 JP578.1 JP579.1 JP580.1 JP581.1 JP582.1 JP583.1 JP584.1 JP585.1 JP586.1 JP587.1 JP588.1 JP589.1 JP590.1 JP591.1 JP592.1 JP593.1 JP594.1 JP595.1 JP596.1 JP597.1 JP598.1 JP599.1 JP600.1 JP601.1 JP602.1 JP603.1 JP604.1 JP605.1 JP606.1 JP607.1 JP608.1 JP609.1 JP610.1 JP611.1 JP612.1 JP613.1 JP614.1 JP615.1 JP616.1 JP617.1 JP618.1 JP619.1 JP620.1 JP621.1 JP622.1 JP623.1 JP624.1 JP625.1 JP626.1 JP627.1 JP628.1 JP629.1 JP630.1 JP631.1 JP632.1 JP633.1 JP634.1 JP635.1 JP636.1 JP637.1 JP638.1 JP639.1 JP640.1 JP641.1 JP642.1 JP643.1 JP644.1 JP645.1 JP646.1 JP647.1 JP648.1 JP649.1 JP650.1 JP651.1 JP652.1 JP653.1 JP654.1 JP655.1 JP656.1 JP657.1 JP658.1 JP659.1 JP660.1 JP661.1 JP662.1 JP663.1 JP664.1 JP665.1 JP666.1 JP667.1 JP668.1 JP669.1 JP670.1 JP671.1 JP672.1 JP673.1 JP674.1 JP675.1 JP676.1 JP677.1 JP678.1 JP679.1 JP680.1 JP681.1 JP682.1 JP683.1 JP684.1 JP685.1 JP686.1 JP687.1 JP688.1 JP689.1 JP690.1 JP691.1 JP692.1 JP693.1 JP694.1 JP695.1 JP696.1 JP697.1 JP698.1 JP699.1 JP700.1 JP701.1 JP702.1 JP703.1 JP704.1 JP705.1 JP706.1 JP707.1 JP708.1 JP709.1 JP710.1 JP711.1 JP712.1 JP713.1 JP714.1 JP715.1 JP716.1 JP717.1 JP718.1 JP719.1 JP720.1 JP721.1 JP722.1 JP741.1 JP785.1 JP786.1 JP787.1 JP791.1 JP792.1 JP793.1 JP794.1 JP843.1 JP844.1 JP845.1 JP846.1 JP847.1 JP848.1 JP849.1 JP850.1 JP851.1 JP852.1 JP853.1 JP854.1 JP855.1 JP856.1 JP857.1 JP858.1 JP859.1 JP860.1 JP861.1 JP862.1 JP863.1 JP864.1 JP865.1 JP866.1 JP867.1 JP868.1 JP869.1 JP870.1 JP871.1 JP872.1 JP873.1 JP874.1 JP875.1 JP876.1 JP877.1 JP878.1 JP879.1 JP880.1 JP881.1 JP882.1 JP883.1 JP884.1 JP885.1 JP886.1 JP887.1 JP888.1 JP889.1 JP890.1 JP891.1 JP892.1 JP893.1 JP894.1 JP895.1 JP896.1 JP897.1 JP898.1 JP899.1 JP900.1 JP901.1 JP902.1 U$1.P$1 U$1.P$2 U$1.P$3 U$1.P$4 U$2.P$1 U$2.P$4

## Notes on the sheet
- D13
  3V3
  VREF
  A0
  A1
  A2
  A3
  A4
  A5
  A6
  A7
  5V
  RST
  GND
  VIN
- D12
  D11
  D10
  D9
  D8
  D7
  D6
  D5
  D4
  D3
  D2
  GND
  RST
  D0/RX
  D1/TX

## Library data of the parts
ARD1 ARD2 = pinhead:PINHD-1X15: PIN HEADER
C5-C7 = rcl:C-EU: CAPACITOR, European symbol; SPICEPREFIX: C
C8 C9 C13 = toggle-nb:CPOL
GATE1 GATE2 = audio-jacks:PJ-324M
IC1 = microchip:MC15*: 2.5V and 4.096V Voltage References Source: http://www.microchip.com .. 21653b.pdf; OC_FARNELL: unknown; OC_NEWARK: unknown
IC2 = SparkFun-IC-Power:V_REG_LD1117VXX: LD1117VXX voltage regulator. We carry the 3.3V version (COM-00526) in TO-220 package.
IC3 = linear:78*: Positive VOLTAGE REGULATOR Source: http://cache.national.com/ds/LM/LM78L05.pdf http://www.fairchildsemi.com/ds/LM/LM7805.pdf
JP1-JP783 JP785-JP787 JP791-JP902 = toggle-nb:1X01
JP788-JP790 = toggle-nb:1X01-WIDE
POWER = SparkFun-Connectors:CONN_05X2: Multi connection point. Often used as Generic Header-pin footprint for 0.1 inch spaced/style header connections For AVR SPI programming port, see special device with nice symbol: "AVR_SPI_PROG_5x2.dev" You can populate with any combo of single row headers, but if you'd like an exact match, check these: 2x5 AVR ICSP Male Header <https://www.sparkfun.com/products/778> (PRT-00778) 2x5 Pin Shrouded Header <https://www.sparkfun.com/products/8506> (PRT-08506) On any of the 0.1 inch spaced packages, you can populate with these: Break Away Headers - Straight <https://www.sparkfun.com/products/116> (PRT-00116) Break Away Male Headers - Right Angle <https://www.sparkfun.com/products/553> (PRT-00553) Female Headers <https://www.sparkfun.com/products/115> (PRT-00115) Break Away Headers - Machine Pin <https://www.sparkfun.com/products/117> (PRT-00117) Break Away Female Headers - Swiss Machine Pin <https://www.sparkfun.com/products/743> (PRT-00743) Special note: the shrouded connector mates well with our 5x2 ribbon cables: 2x5 Pin IDC Ribbon Cable <https://www.sparkfun.com/products/8535> (PRT-08535); PROD_ID: CONN-08671; SF_ID: PRT-08506
R1-R4 = pot:3RP/1610N: 16mm Potentiometer one level Source: http://www.alphapotentiometers.net/html/16mm_pot_2.html
U$1 U$2 = toggle-nb:RIGHTANGLE

## Net classes
0 default: width 0.813 mm, clearance 0.152 mm
1 power: width 0.813 mm, clearance 0.152 mm